# Altium schematic sheet PLD_Connectors_PC-104.SchDoc: Connectors - PC-104
size A4; SheetTotal: 32
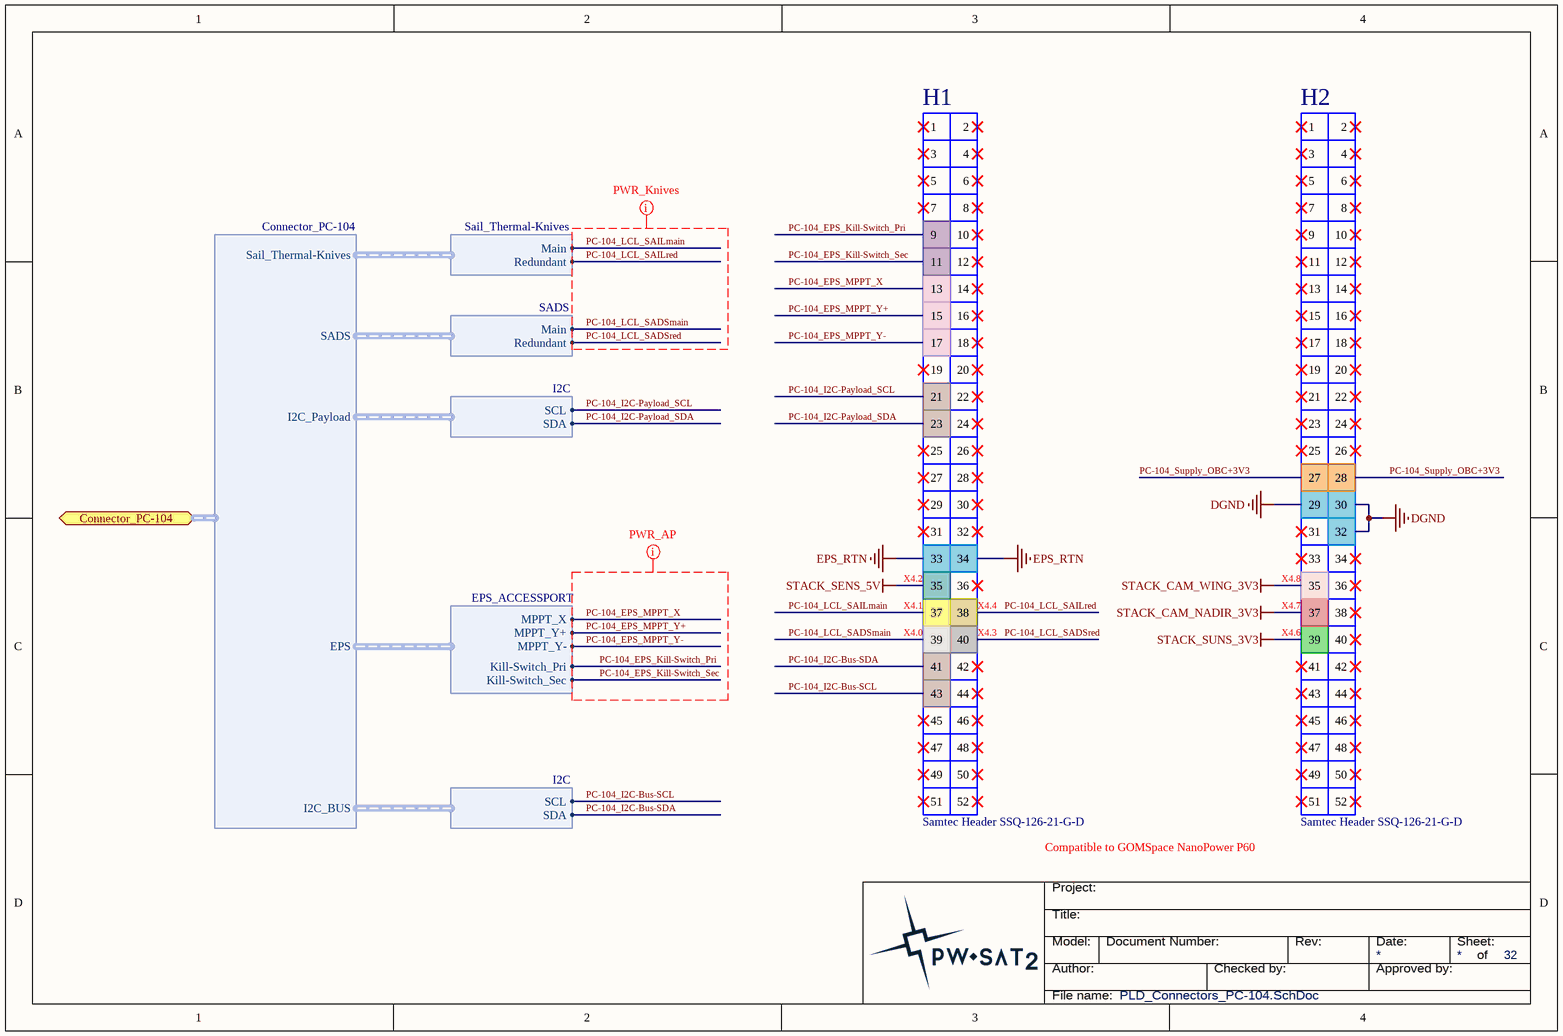
[diagram p0: PLD_Connectors_PC-104.SchDoc]

## Parts
H1  Samtec Header SSQ-126-21-G-D  [Samtec_SSQ-126-21-G-D]
H2  Samtec Header SSQ-126-21-G-D  [Samtec_SSQ-126-21-G-D]

## Ports
Connector_PC-104 (harness Connector_PC-104)

## Harnesses
Connector_PC-104: I2C_Payload, Sail_Thermal-Knives, SADS, I2C_BUS, EPS
Sail_Thermal-Knives: Main, Redundant
SADS: Main, Redundant
I2C: SDA, SCL
EPS_ACCESSPORT: MPPT_X, MPPT_Y+, MPPT_Y-, Kill-Switch_Pri, Kill-Switch_Sec

## Nets
DGND: H2.29 H2.30 H2.32
EPS_RTN: H1.33 H1.34
STACK_CAM_NADIR_3V3: H2.37
STACK_CAM_WING_3V3: H2.35
STACK_SENS_5V: H1.35
STACK_SUNS_3V3: H2.39
PC-104_EPS_Kill-Switch_Pri: H1.9 ; harness EPS_ACCESSPORT.Kill-Switch_Pri
PC-104_EPS_Kill-Switch_Sec: H1.11 ; harness EPS_ACCESSPORT.Kill-Switch_Sec
PC-104_EPS_MPPT_X: H1.13 ; harness EPS_ACCESSPORT.MPPT_X
PC-104_EPS_MPPT_Y+: H1.15 ; harness EPS_ACCESSPORT.MPPT_Y+
PC-104_EPS_MPPT_Y-: H1.17 ; harness EPS_ACCESSPORT.MPPT_Y-
PC-104_I2C-Bus-SCL: H1.43 ; harness I2C.SCL
PC-104_I2C-Bus-SDA: H1.41 ; harness I2C.SDA
PC-104_I2C-Payload_SCL: H1.21 ; harness I2C.SCL
PC-104_I2C-Payload_SDA: H1.23 ; harness I2C.SDA
PC-104_LCL_SADSmain: H1.39 ; harness SADS.Main
PC-104_LCL_SADSred: H1.40 ; harness SADS.Redundant
PC-104_LCL_SAILmain: H1.37 ; harness Sail_Thermal-Knives.Main
PC-104_LCL_SAILred: H1.38 ; harness Sail_Thermal-Knives.Redundant
PC-104_Supply_OBC+3V3: H2.27 H2.28

Not connected (* = marked no-connect by the designer): H1 1* 2* 3* 4* 5* 6* 7* 8* 10* 12* 14* 16* 18* 19* 20* 22* 24* 25* 26* 27* 28* 29* 30* 31* 32* 36* 42* 44* 45* 46* 47* 48* 49* 50* 51* 52*; H2 1* 2* 3* 4* 5* 6* 7* 8* 9* 10* 11* 12* 13* 14* 15* 16* 17* 18* 19* 20* 21* 22* 23* 24* 25* 26* 31* 33* 34* 36* 38* 40* 41* 42* 43* 44* 45* 46* 47* 48* 49* 50* 51* 52*

## Layout directives
net class PWR_Knives: PC-104_LCL_SADSmain, PC-104_LCL_SADSred, PC-104_LCL_SAILmain, PC-104_LCL_SAILred
net class PWR_AP: PC-104_EPS_Kill-Switch_Pri, PC-104_EPS_Kill-Switch_Sec, PC-104_EPS_MPPT_X, PC-104_EPS_MPPT_Y+, PC-104_EPS_MPPT_Y-

## Notes on the sheet
- (near H1) X4.2
- (near H2) X4.8
- (near H1) X4.1
- (near H1) X4.0
- (near H1) X4.4
- (near H1) X4.3
- (near H2) X4.7
- (near H2) X4.6
- Compatible to GOMSpace NanoPower P60
- Title:
- Project:
- Author:
- Model:
- Document Number:
- Checked by:
- Rev:
- Date:
- Approved by:
- Sheet:
- of
- File name:

## Library data of the parts
H1 H2 = Samtec_SSQ-126-xx-x-D: Samtec SSQ Series Header , 2.54mm pitch, 2x26pin. PC-104 Stack Connector.; HelpUrl: http://suddendocs.samtec.com/catalog_english/ssq_th.pdf; Value: Samtec Header SSQ-126-21-G-D